# EAGLE design 9301-7442_adapter_rev1 (EAGLE 9.7.0)
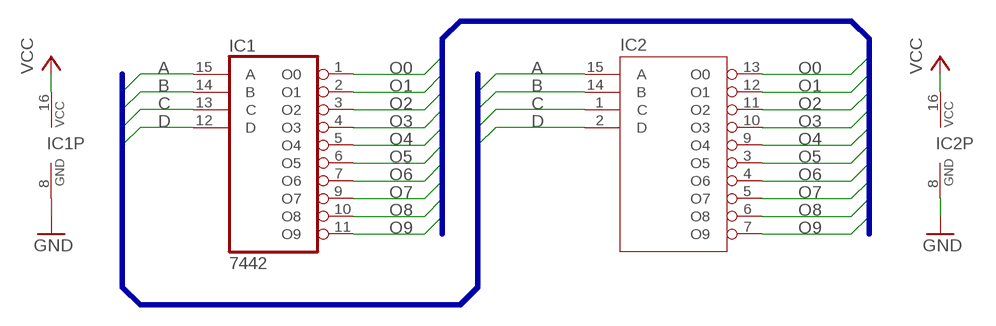
[diagram p0: schematic, sheet 1]

## Parts
IC1  7442  [DIL16]
IC2  9301_DOWNPINS  [DIL16_DOWNPINS]

## Nets
A: IC1.15(A) IC2.15(A)
B: IC1.14(B) IC2.14(B)
C: IC1.13(C) IC2.1(C)
D: IC1.12(D) IC2.2(D)
GND: IC1.8(GND) IC2.8(GND)
O0: IC1.1(O0) IC2.13(O0)
O1: IC1.2(O1) IC2.12(O1)
O2: IC1.3(O2) IC2.11(O2)
O3: IC1.4(O3) IC2.10(O3)
O4: IC1.5(O4) IC2.9(O4)
O5: IC1.6(O5) IC2.3(O5)
O6: IC1.7(O6) IC2.4(O6)
O7: IC1.9(O7) IC2.5(O7)
O8: IC1.10(O8) IC2.6(O8)
O9: IC1.11(O9) IC2.7(O9)
VCC: IC1.16(VCC) IC2.16(VCC)

## Buses
OUTPUT:O[0..9]
INPUT:A,B,C,D

## Library data of the parts
IC1 = Per (Fusion 360):74*42: 4-line to 10-line DECODER (1-of-10)
IC2 = Per (Fusion 360):9301

## Board
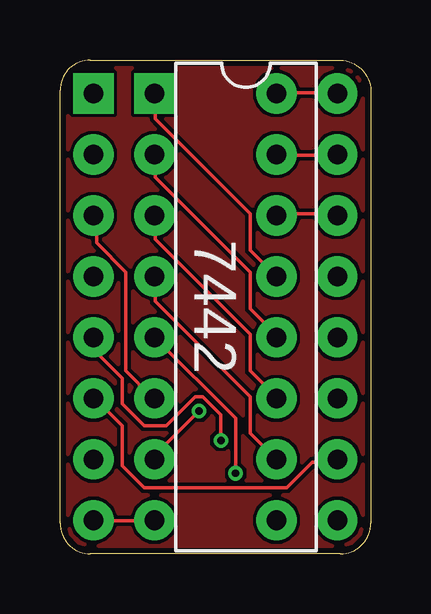
[diagram p1: board, top side]
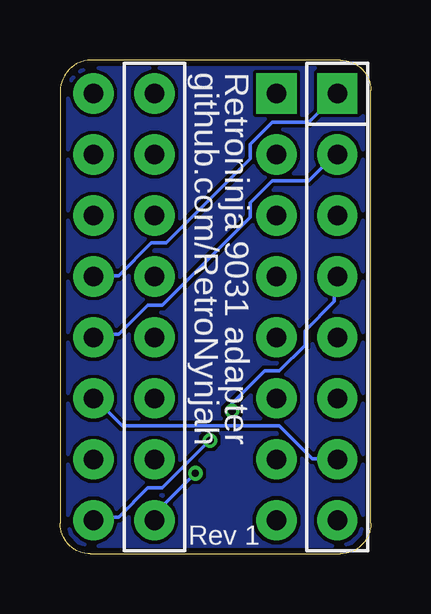
[diagram p2: board, bottom side, seen from below]

Size 12.95 x 20.57 mm. Coordinates in mm from the lower left corner, seen from the top.
Outline: 1.27,20.57 arc90 0,19.3 0,1.27 arc90 1.27,0 11.68,0 arc90 12.95,1.27 12.95,19.3 arc90 11.56,20.57 1.27,20.57
Copper layers (1*16): Top 0.035mm / dielectric 1.5mm / Bottom 0.035mm
Design rules "SeeedStudio_2layer_DRU_no_angle_20140221": minimum track width 6mil, minimum drill 12mil, track to track 6mil, track to pad 6mil, pad to pad 6mil, via to via 6mil, smd to smd 0mil, copper to edge 10mil, drill to drill 10mil, minimum pad ring 10mil, minimum via ring 6mil, stop-mask expansion 2mil, vias tented up to drill 100mil, thermal gap 10mil

### Footprints (pad centres in the part's own frame; a part is rotated, then mirrored left to right if it is on the bottom)
DIL16 = drill 0.813 pad 1.676 square: 1 -8.89,-3.81 | drill 0.813 pad 1.676: 2 -6.35,-3.81; 3 -3.81,-3.81; 4 -1.27,-3.81; 5 1.27,-3.81; 6 3.81,-3.81; 7 6.35,-3.81; 8 8.89,-3.81; 9 8.89,3.81; 10 6.35,3.81; 11 3.81,3.81; 12 1.27,3.81; 13 -1.27,3.81; 14 -3.81,3.81; 15 -6.35,3.81; 16 -8.89,3.81
DIL16_DOWNPINS = drill 0.813 pad 1.676 square: 1 -8.89,-3.81 | drill 0.813 pad 1.676: 2 -6.35,-3.81; 3 -3.81,-3.81; 4 -1.27,-3.81; 5 1.27,-3.81; 6 3.81,-3.81; 7 6.35,-3.81; 8 8.89,-3.81; 9 8.89,3.81; 10 6.35,3.81; 11 3.81,3.81; 12 1.27,3.81; 13 -1.27,3.81; 14 -3.81,3.81; 15 -6.35,3.81; 16 -8.89,3.81

### Placement (x,y rotation side)
IC1  7.75,10.29 270 top
IC2  5.21,10.29 270 top

### Tracks (layer width: path | path; a pad name or v marks a point on that pad's centre or on a via)
A
  Top 0.152: IC2.15 9.14,16.61 11.43,16.61 IC1.15
B
  Top 0.152: IC2.14 9.14,14.17 11.43,14.17 IC1.14
C
  Bottom 0.152: IC2.1 2.59,17.98 4.12,17.98 5.03,17.07 5.03,16.46 8.53,12.95 9.14,12.95 10.52,11.58 11.43,11.58 IC1.13
D
  Bottom 0.152: IC1.12 11.43,9.14 10.52,9.14 9.3,10.36 8.69,10.36 5.03,14.02 5.03,14.63 4.12,15.54 2.59,15.54 1.52,16.61 IC2.2
GND
  Top 0.152: IC2.8 1.52,1.37 3.81,1.37 IC1.8
N$1
  pour Bottom: 0,20.57 0,0 12.95,0 12.95,20.57
N$2
  pour Top: 0,20.57 0,0 12.95,0 12.95,20.57
O0
  Top 0.152: IC2.13 7.92,12.65 7.92,14.17 3.96,18.14 3.96,19.05 IC1.1
O1
  Top 0.152: IC1.2 3.96,16.61 3.96,15.7 7.92,11.73 7.92,10.21 8.99,9.14 IC2.12
O2
  Top 0.152: IC1.3 3.96,14.02 3.96,13.11 7.92,9.14 7.92,7.62 8.99,6.55 IC2.11
O3
  Top 0.152: IC2.10 7.92,5.03 7.92,6.55 3.96,10.52 3.96,11.43 IC1.4
O4  (via drill 0.3)
  Top 0.152: IC1.5 7.32,5.64 v7.32,3.35
  Bottom 0.152: v7.32,3.35 9.14,1.52 IC2.9
O5
  Top 0.152: IC2.3 1.52,14.02 1.52,12.95 2.74,11.73 2.74,7.62 3.81,6.55 IC1.6
O6  (via drill 0.3)
  Top 0.152: v5.79,5.94 3.81,3.96 IC1.7
  Bottom 0.152: v5.79,5.94 5.79,6.25 4.42,7.62 3.81,7.62 2.74,8.69 2.74,9.3 1.52,10.52 1.52,11.43 IC2.4
O7  (via drill 0.3)
  Top 0.152: v6.71,4.72 6.71,5.79 5.94,6.55 5.64,6.55 4.42,5.33 3.5,5.33 2.59,6.25 2.59,7.32 1.52,8.38 1.52,8.99 IC2.5
  Bottom 0.152: v6.71,4.72 8.69,2.74 9.3,2.74 10.52,1.52 11.43,1.52 IC1.9
O8
  Top 0.152: IC1.10 11.43,3.81 10.52,3.81 9.45,2.74 3.5,2.74 2.59,3.66 2.59,5.33 1.52,6.4 IC2.6
O9
  Bottom 0.152: IC2.7 1.52,3.96 2.44,3.96 3.81,5.33 10.36,5.33 11.43,6.4 IC1.11
VCC
  Top 0.152: IC2.16 9.14,19.2 11.43,19.2 IC1.16

### Text on the board
tPlace: 7442
bPlace: Retroninja 9031 adapter | github.com/RetroNynjah | Rev 1